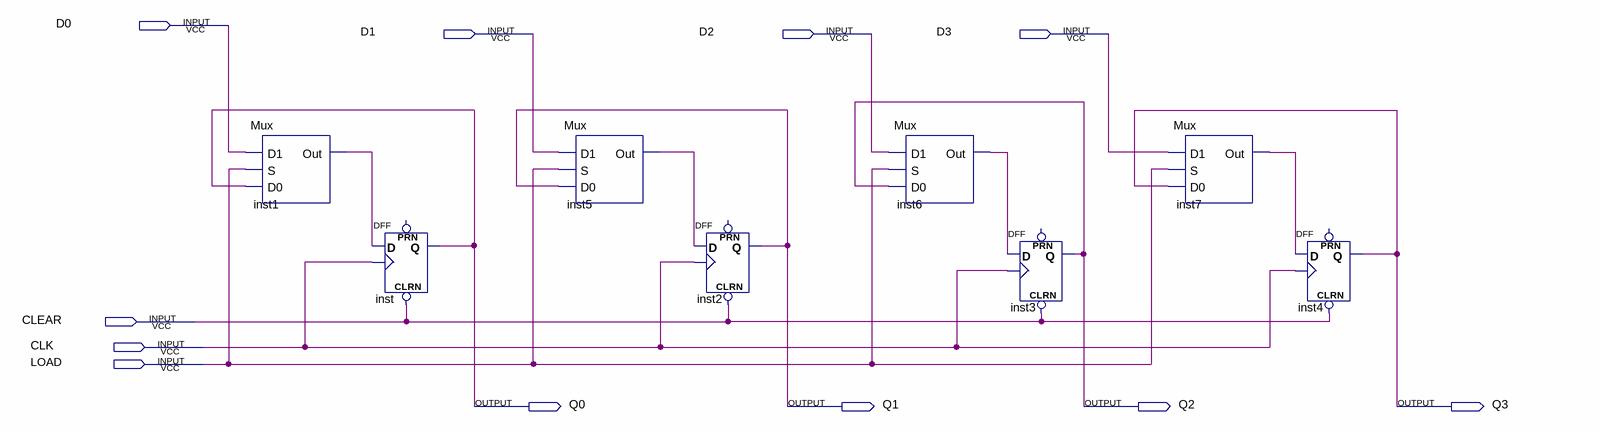
[diagram p0: schematic sheet]
// Quartus schematic Resgistrador.bdf as structural Verilog: 8 symbols, 11 pins
module Resgistrador (
  input  D0,
  input  D1,
  input  D2,
  input  D3,
  input  CLEAR,
  input  CLK,
  input  LOAD,
  output Q0,
  output Q1,
  output Q2,
  output Q3
);

  wire inst1_out, inst5_out, inst6_out, inst7_out;

  Mux inst1 (.D1(D0), .S(LOAD), .D0(Q0), .Out(inst1_out));
  DFF inst (.CLRN(CLEAR), .CLK(CLK), .D(inst1_out), .Q(Q0));  // open: PRN
  Mux inst5 (.D1(D1), .S(LOAD), .D0(Q1), .Out(inst5_out));
  DFF inst2 (.CLRN(CLEAR), .CLK(CLK), .D(inst5_out), .Q(Q1));  // open: PRN
  Mux inst6 (.D1(D2), .S(LOAD), .D0(Q2), .Out(inst6_out));
  DFF inst3 (.CLRN(CLEAR), .CLK(CLK), .D(inst6_out), .Q(Q2));  // open: PRN
  Mux inst7 (.D1(D3), .S(LOAD), .D0(Q3), .Out(inst7_out));
  DFF inst4 (.CLRN(CLEAR), .CLK(CLK), .D(inst7_out), .Q(Q3));  // open: PRN
endmodule
